# Altium project CameraController.PrjPcb (part 1 of 2)
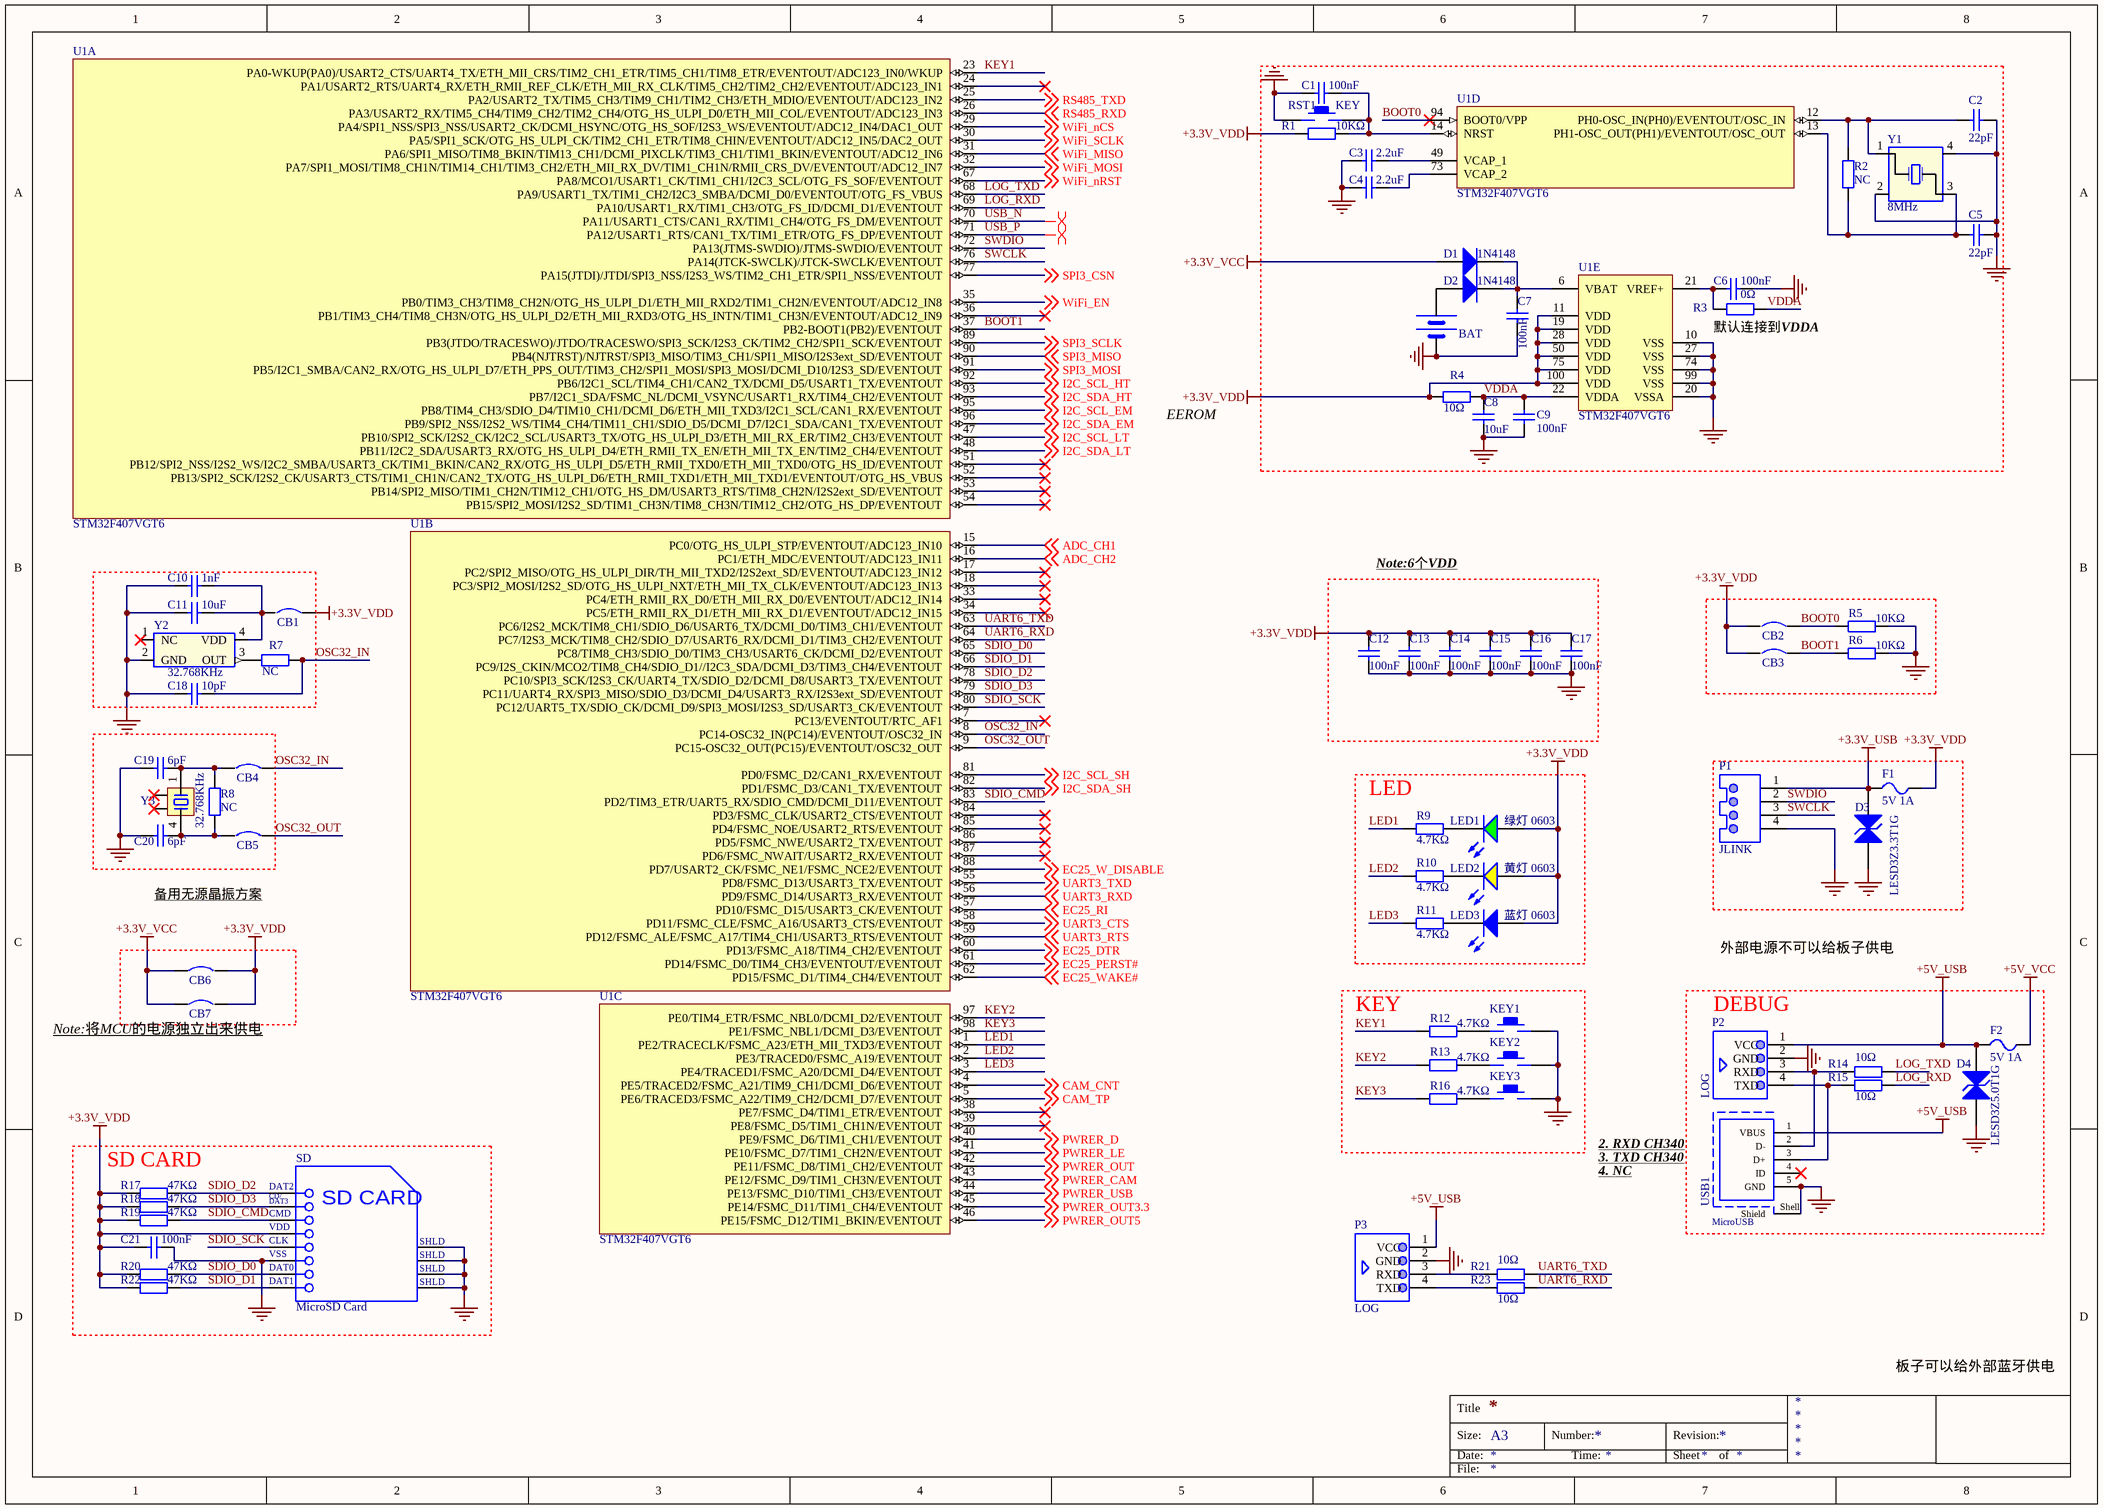
[diagram p0: MCU_F2.SchDoc]
4 sheets, 271 parts. Net scope: global (net labels, ports and power ports of the same name join across sheets).
Board file: Board2.PcbDoc
Sheets:
  MCU_F2.SchDoc
  PWR_F2.SchDoc
  WiFi&4G_F2.SchDoc
  Device_F2.SchDoc

## Sheet MCU_F2.SchDoc
size A3

### Parts
BAT  BAT CR1220  [CR1220_B]  (value not drawn)
C1  100nF  [0603_C]
C2  22pF  [0402_C]
C3  2.2uF  [0603_C]
C4  2.2uF  [0603_C]
C5  22pF  [0402_C]
C6  100nF  [0402_C]
C7  100nF  [0402_C]
C8  10uF  [0805_C]
C9  100nF  [0402_C]
C10  1nF  [0402_C]
C11  10uF  [0603_C]
C12  100nF  [0402_C]
C13  100nF  [0402_C]
C14  100nF  [0402_C]
C15  100nF  [0402_C]
C16  100nF  [0402_C]
C17  100nF  [0402_C]
C18  10pF  [0402_C]
C19  6pF  [0402_C]
C20  6pF  [0402_C]
C21  100nF  [0402_C]
CB1  CB  [CW]  (value not drawn)  (no BOM)
CB2  CB  [CW]  (value not drawn)  (no BOM)
CB3  CB  [CW]  (value not drawn)  (no BOM)
CB4  CB  [CW]  (value not drawn)  (no BOM)
CB5  CB  [CW]  (value not drawn)  (no BOM)
CB6  CB  [CW]  (value not drawn)  (no BOM)
CB7  CB  [CW]  (value not drawn)  (no BOM)
D1  1N4148  [SOD-323]
D2  1N4148  [SOD-323]
D3  LESD3Z3.3T1G  [SOD-323]
D4  LESD3Z5.0T1G  [SOD-323]
F1  5V 1A  [FU 0603]
F2  5V 1A  [FU 0603]
KEY1  KEY  [TSW SMD-6*6*5]  (value not drawn)
KEY2  KEY  [TSW SMD-6*6*5]  (value not drawn)
KEY3  KEY  [TSW SMD-6*6*5]  (value not drawn)
LED1  绿灯 0603  [0603_LED_S1]
LED2  黄灯 0603  [0603_LED_S1]
LED3  蓝灯 0603  [0603_LED_S1]
P1  JLINK  [XH2.54-4P]
P2  LOG  [HDR-4P UART]
P3  LOG  [HDR-4P UART]
R1  10KΩ  [0603_R]
R2  NC  [0402_R]
R3  0Ω  [0402_R]
R4  10Ω  [0402_R]
R5  10KΩ  [0402_R]
R6  10KΩ  [0402_R]
R7  NC  [0402_R]
R8  NC  [0402_R]
R9  4.7KΩ  [0603_R]
R10  4.7KΩ  [0603_R]
R11  4.7KΩ  [0603_R]
R12  4.7KΩ  [0603_R]
R13  4.7KΩ  [0603_R]
R14  10Ω  [0402_R]
R15  10Ω  [0402_R]
R16  4.7KΩ  [0603_R]
R17  47KΩ  [0402_R]
R18  47KΩ  [0402_R]
R19  47KΩ  [0402_R]
R20  47KΩ  [0402_R]
R21  10Ω  [0402_R]
R22  47KΩ  [0402_R]
R23  10Ω  [0402_R]
RST1  KEY  [TSW SMD-4*4*1.5]
SD  MicroSD Card  [MOLX-47219-2001-8_V]
U1  STM32F407VGT6  [STM-LQFP100_L]  (parts A,B,C,D,E of 5)
USB1  MicroUSB  [MOLX-47589-0001]
Y1  8MHz  [XTAL-5032-4P]
Y2  32.768KHz  [XTAL-3225-4P]
Y3  32.768KHz  [OSC MC-306]

### Blocks framed on the sheet
默认连接到VDDA: BAT C1-C9 D1 D2 R1-R4 RST1 U1 Y1
Note:6个VDD: C12-C17
LED: LED1-LED3 R9-R11
KEY: KEY1-KEY3 R12 R13 R16
DEBUG: D4 F2 P2 R14 R15 USB1
SD CARD: C21 R17-R20 R22 SD

### Nets
+3.3V_USB: D3.2(K) F1.1 P1.1
+3.3V_VCC: CB6.1 CB7.1 D1.1(A)
+3.3V_VDD: C12.1 C13.1 C14.1 C15.1 C16.1 C17.1 C21.1 CB1.2 CB2.1 CB3.1 CB6.2 CB7.2 F1.2 LED1.A LED2.A LED3.A R1.1 R4.1 R17.1 R18.1 R19.1 R20.1 R22.1 SD.4(VDD) U1.11(VDD) U1.19(VDD) U1.28(VDD) U1.50(VDD) U1.75(VDD) U1.100(VDD)
+5V_USB: D4.2(K) F2.1 P2.1(VCC) P3.1(VCC) USB1.1(VBUS)
+5V_VCC: F2.2
GND: BAT.2(GND) C1.1 C2.2 C3.1 C4.1 C5.2 C6.1 C7.2 C8.1 C9.1 C10.1 C11.1 C12.2 C13.2 C14.2 C15.2 C16.2 C17.2 C18.1 C19.2 C20.2 C21.2 D3.1(A) D4.1(A) KEY1.2 KEY2.2 KEY3.2 P1.4 P2.2(GND) P3.2(GND) R5.2 R6.2 RST1.1 SD.6(VSS) SD.9(SHLD) SD.10(SHLD) SD.11(SHLD) SD.12(SHLD) U1.10(VSS) U1.20(VSSA) U1.27(VSS) U1.74(VSS) U1.99(VSS) USB1.5(GND) USB1.Shell(Shield) Y1.2 Y1.4 Y2.2(GND)
ADC_CH1: U1.15(PC0/OTG_HS_ULPI_STP/EVENTOUT/ADC123_IN10) ; off-sheet ADC_CH1
ADC_CH2: U1.16(PC1/ETH_MDC/EVENTOUT/ADC123_IN11) ; off-sheet ADC_CH2
BOOT0: CB2.2 R5.1 U1.94(BOOT0/VPP)
BOOT1: CB3.2 R6.1 U1.37(PB2-BOOT1(PB2)/EVENTOUT)
CAM_CNT: U1.4(PE5/TRACED2/FSMC_A21/TIM9_CH1/DCMI_D6/EVENTOUT) ; off-sheet CAM_CNT
CAM_TP: U1.5(PE6/TRACED3/FSMC_A22/TIM9_CH2/DCMI_D7/EVENTOUT) ; off-sheet CAM_TP
EC25_DTR: U1.60(PD13/FSMC_A18/TIM4_CH2/EVENTOUT) ; off-sheet EC25_DTR
EC25_PERST#: U1.61(PD14/FSMC_D0/TIM4_CH3/EVENTOUT/EVENTOUT) ; off-sheet EC25_PERST#
EC25_RI: U1.57(PD10/FSMC_D15/USART3_CK/EVENTOUT) ; off-sheet EC25_RI
EC25_W_DISABLE: U1.88(PD7/USART2_CK/FSMC_NE1/FSMC_NCE2/EVENTOUT) ; off-sheet EC25_W_DISABLE
EC25_WAKE#: U1.62(PD15/FSMC_D1/TIM4_CH4/EVENTOUT) ; off-sheet EC25_WAKE#
I2C_SCL_EM: U1.95(PB8/TIM4_CH3/SDIO_D4/TIM10_CH1/DCMI_D6/ETH_MII_TXD3/I2C1_SCL/CAN1_RX/EVENTOUT) ; off-sheet I2C_SCL_EM
I2C_SCL_HT: U1.92(PB6/I2C1_SCL/TIM4_CH1/CAN2_TX/DCMI_D5/USART1_TX/EVENTOUT) ; off-sheet I2C_SCL_HT
I2C_SCL_LT: U1.47(PB10/SPI2_SCK/I2S2_CK/I2C2_SCL/USART3_TX/OTG_HS_ULPI_D3/ETH_MII_RX_ER/TIM2_CH3/EVENTOUT) ; off-sheet I2C_SCL_LT
I2C_SCL_SH: U1.81(PD0/FSMC_D2/CAN1_RX/EVENTOUT) ; off-sheet I2C_SCL_SH
I2C_SDA_EM: U1.96(PB9/SPI2_NSS/I2S2_WS/TIM4_CH4/TIM11_CH1/SDIO_D5/DCMI_D7/I2C1_SDA/CAN1_TX/EVENTOUT) ; off-sheet I2C_SDA_EM
I2C_SDA_HT: U1.93(PB7/I2C1_SDA/FSMC_NL/DCMI_VSYNC/USART1_RX/TIM4_CH2/EVENTOUT) ; off-sheet I2C_SDA_HT
I2C_SDA_LT: U1.48(PB11/I2C2_SDA/USART3_RX/OTG_HS_ULPI_D4/ETH_RMII_TX_EN/ETH_MII_TX_EN/TIM2_CH4/EVENTOUT) ; off-sheet I2C_SDA_LT
I2C_SDA_SH: U1.82(PD1/FSMC_D3/CAN1_TX/EVENTOUT) ; off-sheet I2C_SDA_SH
KEY1: R12.1 U1.23(PA0-WKUP(PA0)/USART2_CTS/UART4_TX/ETH_MII_CRS/TIM2_CH1_ETR/TIM5_CH1/TIM8_ETR/EVENTOUT/ADC123_IN0/WKUP)
KEY2: R13.1 U1.97(PE0/TIM4_ETR/FSMC_NBL0/DCMI_D2/EVENTOUT)
KEY3: R16.1 U1.98(PE1/FSMC_NBL1/DCMI_D3/EVENTOUT)
LED1: R9.1 U1.1(PE2/TRACECLK/FSMC_A23/ETH_MII_TXD3/EVENTOUT)
LED2: R10.1 U1.2(PE3/TRACED0/FSMC_A19/EVENTOUT)
LED3: R11.1 U1.3(PE4/TRACED1/FSMC_A20/DCMI_D4/EVENTOUT)
LOG_RXD: R15.2 U1.69(PA10/USART1_RX/TIM1_CH3/OTG_FS_ID/DCMI_D1/EVENTOUT)
LOG_TXD: R14.2 U1.68(PA9/USART1_TX/TIM1_CH2/I2C3_SMBA/DCMI_D0/EVENTOUT/OTG_FS_VBUS)
OSC32_IN: C18.2 CB4.2 R7.2 U1.8(PC14-OSC32_IN(PC14)/EVENTOUT/OSC32_IN)
OSC32_OUT: CB5.2 U1.9(PC15-OSC32_OUT(PC15)/EVENTOUT/OSC32_OUT)
PWRER_CAM: U1.43(PE12/FSMC_D9/TIM1_CH3N/EVENTOUT) ; off-sheet PWRER_CAM
PWRER_D: U1.40(PE9/FSMC_D6/TIM1_CH1/EVENTOUT) ; off-sheet PWRER_D
PWRER_LE: U1.41(PE10/FSMC_D7/TIM1_CH2N/EVENTOUT) ; off-sheet PWRER_LE
PWRER_OUT: U1.42(PE11/FSMC_D8/TIM1_CH2/EVENTOUT) ; off-sheet PWRER_OUT
PWRER_OUT3.3: U1.45(PE14/FSMC_D11/TIM1_CH4/EVENTOUT) ; off-sheet PWRER_OUT3.3
PWRER_OUT5: U1.46(PE15/FSMC_D12/TIM1_BKIN/EVENTOUT) ; off-sheet PWRER_OUT5
PWRER_USB: U1.44(PE13/FSMC_D10/TIM1_CH3/EVENTOUT) ; off-sheet PWRER_USB
RS485_RXD: U1.26(PA3/USART2_RX/TIM5_CH4/TIM9_CH2/TIM2_CH4/OTG_HS_ULPI_D0/ETH_MII_COL/EVENTOUT/ADC123_IN3) ; off-sheet RS485_RXD
RS485_TXD: U1.25(PA2/USART2_TX/TIM5_CH3/TIM9_CH1/TIM2_CH3/ETH_MDIO/EVENTOUT/ADC123_IN2) ; off-sheet RS485_TXD
SDIO_CMD: R19.2 SD.3(CMD) U1.83(PD2/TIM3_ETR/UART5_RX/SDIO_CMD/DCMI_D11/EVENTOUT)
SDIO_D0: R20.2 SD.7(DAT0) U1.65(PC8/TIM8_CH3/SDIO_D0/TIM3_CH3/USART6_CK/DCMI_D2/EVENTOUT)
SDIO_D1: R22.2 SD.8(DAT1) U1.66(PC9/I2S_CKIN/MCO2/TIM8_CH4/SDIO_D1//I2C3_SDA/DCMI_D3/TIM3_CH4/EVENTOUT)
SDIO_D2: R17.2 SD.1(DAT2) U1.78(PC10/SPI3_SCK/I2S3_CK/UART4_TX/SDIO_D2/DCMI_D8/USART3_TX/EVENTOUT)
SDIO_D3: R18.2 SD.2(CD/DAT3) U1.79(PC11/UART4_RX/SPI3_MISO/SDIO_D3/DCMI_D4/USART3_RX/I2S3ext_SD/EVENTOUT)
SDIO_SCK: SD.5(CLK) U1.80(PC12/UART5_TX/SDIO_CK/DCMI_D9/SPI3_MOSI/I2S3_SD/USART3_CK/EVENTOUT)
SPI3_CSN: U1.77(PA15(JTDI)/JTDI/SPI3_NSS/I2S3_WS/TIM2_CH1_ETR/SPI1_NSS/EVENTOUT) ; off-sheet SPI3_CSN
SPI3_MISO: U1.90(PB4(NJTRST)/NJTRST/SPI3_MISO/TIM3_CH1/SPI1_MISO/I2S3ext_SD/EVENTOUT) ; off-sheet SPI3_MISO
SPI3_MOSI: U1.91(PB5/I2C1_SMBA/CAN2_RX/OTG_HS_ULPI_D7/ETH_PPS_OUT/TIM3_CH2/SPI1_MOSI/SPI3_MOSI/DCMI_D10/I2S3_SD/EVENTOUT) ; off-sheet SPI3_MOSI
SPI3_SCLK: U1.89(PB3(JTDO/TRACESWO)/JTDO/TRACESWO/SPI3_SCK/I2S3_CK/TIM2_CH2/SPI1_SCK/EVENTOUT) ; off-sheet SPI3_SCLK
SWCLK: P1.3 U1.76(PA14(JTCK-SWCLK)/JTCK-SWCLK/EVENTOUT)
SWDIO: P1.2 U1.72(PA13(JTMS-SWDIO)/JTMS-SWDIO/EVENTOUT)
UART3_CTS: U1.58(PD11/FSMC_CLE/FSMC_A16/USART3_CTS/EVENTOUT) ; off-sheet UART3_CTS
UART3_RTS: U1.59(PD12/FSMC_ALE/FSMC_A17/TIM4_CH1/USART3_RTS/EVENTOUT) ; off-sheet UART3_RTS
UART3_RXD: U1.56(PD9/FSMC_D14/USART3_RX/EVENTOUT) ; off-sheet UART3_RXD
UART3_TXD: U1.55(PD8/FSMC_D13/USART3_TX/EVENTOUT) ; off-sheet UART3_TXD
UART6_RXD: R23.2 U1.64(PC7/I2S3_MCK/TIM8_CH2/SDIO_D7/USART6_RX/DCMI_D1/TIM3_CH2/EVENTOUT)
UART6_TXD: R21.2 U1.63(PC6/I2S2_MCK/TIM8_CH1/SDIO_D6/USART6_TX/DCMI_D0/TIM3_CH1/EVENTOUT)
USB_N: U1.70(PA11/USART1_CTS/CAN1_RX/TIM1_CH4/OTG_FS_DM/EVENTOUT)
USB_P: U1.71(PA12/USART1_RTS/CAN1_TX/TIM1_ETR/OTG_FS_DP/EVENTOUT)
VDDA: C8.2 C9.2 R3.2 R4.2 U1.22(VDDA)
WiFi_EN: U1.35(PB0/TIM3_CH3/TIM8_CH2N/OTG_HS_ULPI_D1/ETH_MII_RXD2/TIM1_CH2N/EVENTOUT/ADC12_IN8) ; off-sheet WiFi_EN
WiFi_MISO: U1.31(PA6/SPI1_MISO/TIM8_BKIN/TIM13_CH1/DCMI_PIXCLK/TIM3_CH1/TIM1_BKIN/EVENTOUT/ADC12_IN6) ; off-sheet WiFi_MISO
WiFi_MOSI: U1.32(PA7/SPI1_MOSI/TIM8_CH1N/TIM14_CH1/TIM3_CH2/ETH_MII_RX_DV/TIM1_CH1N/RMII_CRS_DV/EVENTOUT/ADC12_IN7) ; off-sheet WiFi_MOSI
WiFi_nCS: U1.29(PA4/SPI1_NSS/SPI3_NSS/USART2_CK/DCMI_HSYNC/OTG_HS_SOF/I2S3_WS/EVENTOUT/ADC12_IN4/DAC1_OUT) ; off-sheet WiFi_nCS
WiFi_nRST: U1.67(PA8/MCO1/USART1_CK/TIM1_CH1/I2C3_SCL/OTG_FS_SOF/EVENTOUT) ; off-sheet WiFi_nRST
WiFi_SCLK: U1.30(PA5/SPI1_SCK/OTG_HS_ULPI_CK/TIM2_CH1_ETR/TIM8_CHIN/EVENTOUT/ADC12_IN5/DAC2_OUT) ; off-sheet WiFi_SCLK
NetBAT_1: BAT.1(VCC) D2.1(A)
NetC1_2: C1.2 R1.2 RST1.2 U1.14(NRST)
NetC2_1: C2.1 R2.2 U1.12(PH0-OSC_IN(PH0)/EVENTOUT/OSC_IN) Y1.1
NetC3_2: C3.2 U1.49(VCAP_1)
NetC4_2: C4.2 U1.73(VCAP_2)
NetC5_1: C5.1 R2.1 U1.13(PH1-OSC_OUT(PH1)/EVENTOUT/OSC_OUT) Y1.3
NetC6_2: C6.2 R3.1 U1.21(VREF+)
NetC7_1: C7.1 D1.2(K) D2.2(K) U1.6(VBAT)
NetC10_2: C10.2 C11.2 CB1.1 Y2.4(VDD)
NetC19_1: C19.1 CB4.1 R8.1 Y3.1
NetC20_1: C20.1 CB5.1 R8.2 Y3.4
NetKEY1_1: KEY1.1 R12.2
NetKEY2_1: KEY2.1 R13.2
NetKEY3_1: KEY3.1 R16.2
NetLED1_K: LED1.K R9.2
NetLED2_K: LED2.K R10.2
NetLED3_K: LED3.K R11.2
NetP2_3: P2.3(RXD) R14.1 USB1.2(D-)
NetP2_4: P2.4(TXD) R15.1 USB1.3(D+)
NetP3_3: P3.3(RXD) R21.1
NetP3_4: P3.4(TXD) R23.1
NetR7_1: R7.1 Y2.3(OUT)

Not connected (* = marked no-connect by the designer): U1 7(PC13/EVENTOUT/RTC_AF1)* 17(PC2/SPI2_MISO/OTG_HS_ULPI_DIR/TH_MII_TXD2/I2S2ext_SD/EVENTOUT/ADC123_IN12)* 18(PC3/SPI2_MOSI/I2S2_SD/OTG_HS_ULPI_NXT/ETH_MII_TX_CLK/EVENTOUT/ADC123_IN13)* 24(PA1/USART2_RTS/UART4_RX/ETH_RMII_REF_CLK/ETH_MII_RX_CLK/TIM5_CH2/TIM2_CH2/EVENTOUT/ADC123_IN1)* 33(PC4/ETH_RMII_RX_D0/ETH_MII_RX_D0/EVENTOUT/ADC12_IN14)* 34(PC5/ETH_RMII_RX_D1/ETH_MII_RX_D1/EVENTOUT/ADC12_IN15)* 36(PB1/TIM3_CH4/TIM8_CH3N/OTG_HS_ULPI_D2/ETH_MII_RXD3/OTG_HS_INTN/TIM1_CH3N/EVENTOUT/ADC12_IN9)* 38(PE7/FSMC_D4/TIM1_ETR/EVENTOUT)* 39(PE8/FSMC_D5/TIM1_CH1N/EVENTOUT)* 51(PB12/SPI2_NSS/I2S2_WS/I2C2_SMBA/USART3_CK/TIM1_BKIN/CAN2_RX/OTG_HS_ULPI_D5/ETH_RMII_TXD0/ETH_MII_TXD0/OTG_HS_ID/EVENTOUT)* 52(PB13/SPI2_SCK/I2S2_CK/USART3_CTS/TIM1_CH1N/CAN2_TX/OTG_HS_ULPI_D6/ETH_RMII_TXD1/ETH_MII_TXD1/EVENTOUT/OTG_HS_VBUS)* 53(PB14/SPI2_MISO/TIM1_CH2N/TIM12_CH1/OTG_HS_DM/USART3_RTS/TIM8_CH2N/I2S2ext_SD/EVENTOUT)* 54(PB15/SPI2_MOSI/I2S2_SD/TIM1_CH3N/TIM8_CH3N/TIM12_CH2/OTG_HS_DP/EVENTOUT)* 84(PD3/FSMC_CLK/USART2_CTS/EVENTOUT)* 85(PD4/FSMC_NOE/USART2_RTS/EVENTOUT)* 86(PD5/FSMC_NWE/USART2_TX/EVENTOUT)* 87(PD6/FSMC_NWAIT/USART2_RX/EVENTOUT)*; USB1 4(ID)*; Y2 1(NC)*; Y3 2* 3*

### Layout directives
differential pair: USB_N, USB_P

### Notes on the sheet
- EEROM
- 备用无源晶振方案
- 外部电源不可以给板子供电
- (near CB7) Note:将MCU的电源独立出来供电
- 2. RXD CH340
- 3. TXD CH340
- 4. NC
- 板子可以给外部蓝牙供电
- Title
- Size:
- Date:
- A3
- Number:
- Time:
- Revision:
- Sheet
- of
- File:
- *
- (in symbol MicroSD_Card) CD/; DAT3; SD CARD

### Library data of the parts
C1 = Cap 0603 100nF (104) 10% 50V: 贴片电容; ComponentLink1Description: 供应商链接; ComponentLink1URL: http://www.szlcsc.com/product/details_15331.html; Package: 0603; Supplier: LC; SuppliersPartNumber: C14663
C2 C5 = Cap 0402 22pF (220) 5% 50V: 贴片电容; ComponentLink1Description: 供应商链接; ComponentLink1URL: http://www.szlcsc.com/product/details_1907.html; Package: 0402; Supplier: LC; SuppliersPartNumber: C1555
C3 C4 = Cap 0603 2.2uF (225) 10% 16V: 贴片电容; ComponentLink1Description: 供应商链接; ComponentLink1URL: http://www.szlcsc.com/product/details_24366.html; Package: 0603; Supplier: LC; SuppliersPartNumber: C23630
C6 C7 C9 C12-C17 C21 = Cap 0402 100nF (104) 10% 16V: 贴片电容; ComponentLink1Description: 供应商链接; ComponentLink1URL: http://www.szlcsc.com/product/details_1877.html; Package: 0402; Supplier: LC; SuppliersPartNumber: C1525
  C12: Value: 100nF
C8 = Cap 0805 10uF (106) 10% 25V: 贴片电容; ComponentLink1Description: 供应商链接; ComponentLink1URL: http://www.szlcsc.com/product/details_16532.html; Package: 0805; Supplier: LC; SuppliersPartNumber: C15850; Value: 10uF
C10 = Cap 0402 1nF (102) 10% 50V: 贴片电容; ComponentLink1Description: 供应商链接; ComponentLink1URL: http://www.szlcsc.com/product/details_1875.html; Package: 0402; Supplier: LC; SuppliersPartNumber: C1523; Value: 1nF
C11 = Cap 0603 10uF (106) 10% 10V: 贴片电容; ComponentLink1Description: 供应商链接; ComponentLink1URL: http://www.szlcsc.com/product/details_20411.html; Package: 0603; Supplier: LC; SuppliersPartNumber: C19702
C18 = Cap 0402 10pF (100) 5% 50V: 贴片电容; ComponentLink1Description: 供应商链接; ComponentLink1URL: http://www.szlcsc.com/product/details_33914.html; Package: 0402; Supplier: LC; SuppliersPartNumber: C32949
C19 C20 = Cap 0402 6pF (6R0) 0.25pF 50V: 贴片电容; ComponentLink1Description: 供应商链接; ComponentLink1URL: http://www.szlcsc.com/product/details_31031.html; Package: 0402; Supplier: LC; SuppliersPartNumber: C30274
CB1-CB7 = Circuit Breaker: Published: 24-Mar-1999; LatestRevisionDate: 17-Jul-2002; LatestRevisionNote: Re-released for DXP Platform.; PackageReference: SPST-2; Publisher: Altium Limited
D1 D2 = DIO SOD-323 1N4148WS T4: 二极管; ComponentLink1Description: 供应商链接; ComponentLink1URL: http://www.szlcsc.com/product/details_2485.html; Package: SOD-323; Supplier: LC; SuppliersPartNumber: C2128
D3 = SOD-323 LESD3Z3.3T1G: TVS/ESD, SOD-323, 3.3V; ComponentLink1Description: 供应商链接; ComponentLink1URL: http://www.szlcsc.com/product/details_79530.html; Package: SMB/DO-214AA; Supplier: LC; SuppliersPartNumber: C78395
D4 = SOD-323 LESD3Z5.0T1G: TVS/ESD, SOD-323, 5V; ComponentLink1Description: 供应商链接; ComponentLink1URL: http://www.szlcsc.com/product/details_79530.html; Package: SMB/DO-214AA; Supplier: LC; SuppliersPartNumber: C78395
F1 F2 = FU PPTC MSMD 5V 1A: 自恢复保险丝; BOM名称: 贴片保险丝; 版权归属: 源创客; 学习资源: www.ooocke.com
KEY1-KEY3 = KEY_M
LED1 = LED 0603 绿灯: 发光二极管; ComponentLink1Description: 供应商链接; ComponentLink1URL: http://www.szlcsc.com/product/details_73152.html; Package: 0603; Supplier: LC; SuppliersPartNumber: C72043
LED2 = LED 0603 黄灯: 发光二极管; ComponentLink1Description: 供应商链接; ComponentLink1URL: http://www.szlcsc.com/product/details_73147.html; Package: 0603; Supplier: LC; SuppliersPartNumber: C72038
LED3 = LED 0603 蓝灯: 发光二极管; ComponentLink1Description: 供应商链接; ComponentLink1URL: http://www.szlcsc.com/product/details_73150.html; Package: 0603; Supplier: LC; SuppliersPartNumber: C72041
P1 = Header XH-2.56-4P: Male Header, Pitch 2.5 mm, 1 x 4 Position, Height 7 mm, Tail Length 8.4 mm, -25 to 85 degC, RoHS, Bulk; Manufacturer: JST; No of Positions: 2; Pitch: 2.5mm; Style/Orientation: StraightHeader/Plug; Datasheet Version: 05/2016; Package Description: Male Header, Pitch 2.5 mm, 1 x 2 Position, Height 7 mm, Tail Length 3.4 mm; Package Reference: B2B-XH-A; Mounting Technology: ThroughHole; Type: ShroudedHeader; Datasheet URL: http://www.jst-mfg.com/product/pdf/eng/eXH.pdf; Manufacturer URL: http://www.jst.com/home2.html; Termination: Crimp
P2 P3 = HAR-4P UART: Header, 4-Pin; LatestRevisionDate: 17-Jul-2002; LatestRevisionNote: Re-released for DXP Platform.; Publisher: Altium Limited
R1 = Res 0603 10KΩ (1002) 1%: 贴片电阻; ComponentLink1Description: 供应商链接; ComponentLink1URL: http://www.szlcsc.com/product/details_26547.html; Package: 0603; Supplier: LC; SuppliersPartNumber: C25804
R2 R8 = Res 0402 1MΩ (1004) 1%: 贴片电阻; Value: 1MΩ; ComponentLink1Description: 供应商链接; ComponentLink1URL: http://www.szlcsc.com/product/details_26826.html; Package: 0402; Supplier: LC; SuppliersPartNumber: C26083
R3 = Res 0402 0Ω (0R0) 1%: 贴片电阻; ComponentLink1Description: 供应商链接; ComponentLink1URL: http://www.szlcsc.com/product/details_17853.html; Package: 0402; Supplier: LC; SuppliersPartNumber: C17168; Value: 0Ω
R4 R7 R14 R15 R21 R23 = Res 0402 10Ω (10R0) 1%: 贴片电阻; ComponentLink1Description: 供应商链接; ComponentLink1URL: http://www.szlcsc.com/product/details_25820.html; Package: 0402; Supplier: LC; SuppliersPartNumber: C25077
R5 R6 = Res 0402 10KΩ (1002) 1%: 贴片电阻; ComponentLink1Description: 供应商链接; ComponentLink1URL: http://www.szlcsc.com/product/details_26487.html; Package: 0402; Supplier: LC; SuppliersPartNumber: C25744; Value: 10KΩ
R9-R13 R16 = Res 0603 4.7KΩ (4701) 1%: 贴片电阻; ComponentLink1Description: 供应商链接; ComponentLink1URL: http://www.szlcsc.com/product/details_23889.html; Package: 0603; Supplier: LC; SuppliersPartNumber: C23162
R17-R20 R22 = Res 0402 47KΩ (4702) 1%: 贴片电阻; ComponentLink1Description: 供应商链接; ComponentLink1URL: http://www.szlcsc.com/product/details_26535.html; Package: 0402; Supplier: LC; SuppliersPartNumber: C25792
RST1 = KEY_TWS
SD = MicroSD_Card: MicroSD Card Connector, Hinge Type, -40 to 85 degC, 8-Pin SMD, RoHS, Tape and Reel, CMP-2000-05245-1; Manufacturer: Molex; Current Rating: 500mA; Number of Contacts: 8; Pitch: 1.09mm; Insertion - Extraction Style: Hinged; Voltage Rating: 100VDC; Product: CardConnectors; Contact Material: CopperAlloy; Series: 47219; Packaging: Reel; Brand: Molex; Product Category: MemoryCardConnectors; Housing Material: Thermoplastic; Mounting Style: SMD/SMT; Termination Style: SMD; Datasheet Version: Rev. F, 06/2009; Card Type: microSD; Manufacturer URL: http://www.molex.com/; RoHS: Details; Datasheet URL: http://www.molex.com/pdm_docs/sd/472192001_sd.pdf; Factory Pack Quantity: 2400
U1 = STM32F407VGT6: ARM; ComponentLink1Description: 供应商链接; ComponentLink1URL: http://www.szlcsc.com/product/details_12968.html; Package: LQFP-100_14x14x05P; Supplier: LC; SuppliersPartNumber: C12345
USB1 = MicroUSB MOLX-47589-0001: Right Angle Female Type AB Micro USB Connector, 30 V, 1.8 A, -30 to 85 degC, RoHS, Tape and Reel; Part Number: 629105150921; Manufacturer: Wurth Elektronik; Rated Current: 1.8A; Contact Resistance: 30mOhm; Gender: Receptacle; Working Voltage: 30VAC; Connector Type: MicroUSB2.0TypeAB; Publisher: WurthElektronik; Operating Temperature: -40to85degC; Packaging: TapeandReel; Datasheet URL: https://katalog.we-online.de/em/datasheet/629105150921.pdf; Mounting Technology: SMT; Orientation: Horizontal; Package Reference: 629105150921; Manufacturer URL: http://www.we-online.de
Y1 = XTAL SMD-5032_4P 8MHz 10ppm 20pF: 贴片晶振; 402F40012IKR; 8MHz 10ppm 20pF -40C +85C; CLASS: IC
Y2 = XTAL SMD-3225 32.768KHz: 有源贴片晶振; CLASS: IC
Y3 = XTAL-MC306: 4脚晶振; 版权归属: 源创客; BOM名称: 4脚晶振; 学习资源: www.ooocke.com

## Sheet PWR_F2.SchDoc
size A3; Organization: Altium Limited; Address1: L3, 12a Rodborough Rd; Address2: Frenchs Forest; Address3: NSW; Address4: Australia 2086
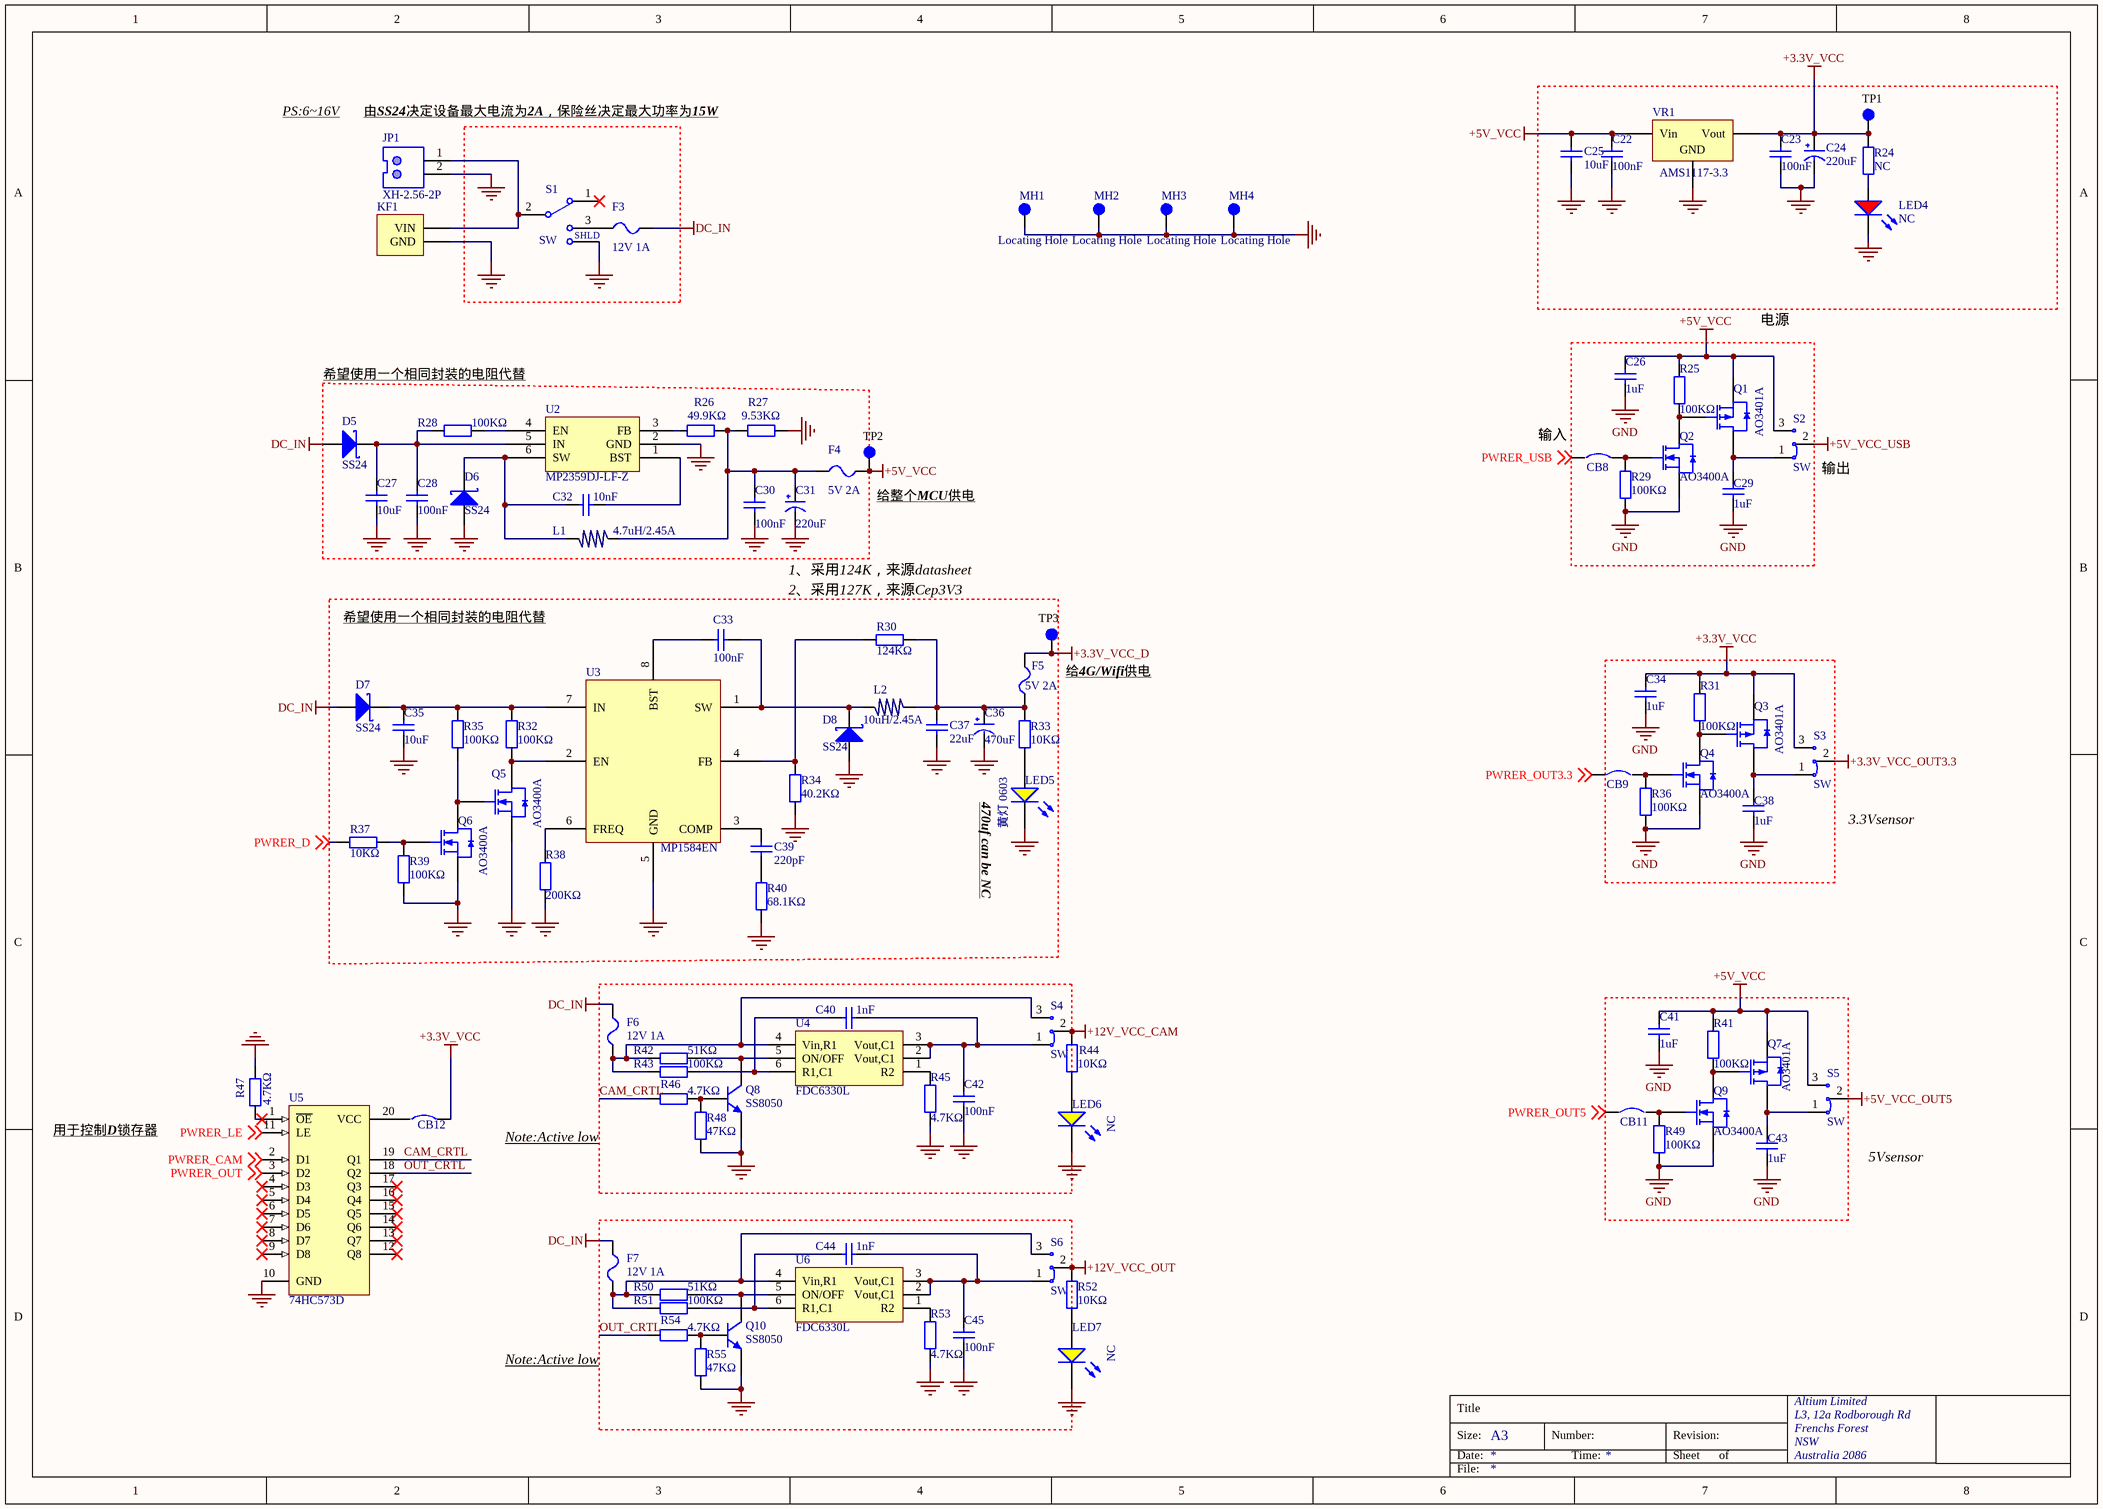
[diagram p1: PWR_F2.SchDoc]

### Parts
C22  100nF  [0603_C]
C23  100nF  [0603_C]
C24  220uF  [CT 6*6 - C]
C25  10uF  [0805_C]
C26  1uF  [0603_C]
C27  10uF  [0805_C]
C28  100nF  [0603_C]
C29  1uF  [0603_C]
C30  100nF  [0603_C]
C31  220uF  [CT 6*6 - C]
C32  10nF  [0603_C]
C33  100nF  [0603_C]
C34  1uF  [0603_C]
C35  10uF  [1206_C]
C36  470uF  [CT 8*7 - C]
C37  22uF  [0805_C]
C38  1uF  [0603_C]
C39  220pF  [0603_C]
C40  1nF  [0603_C]
C41  1uF  [0603_C]
C42  100nF  [0603_C]
C43  1uF  [0603_C]
C44  1nF  [0603_C]
C45  100nF  [0603_C]
CB8  CB  [CW]  (value not drawn)  (no BOM)
CB9  CB  [CW]  (value not drawn)  (no BOM)
CB11  CB  [CW]  (value not drawn)  (no BOM)
CB12  CB  [CW]  (value not drawn)  (no BOM)
D5  SS24  [SMA(DO-214AC)_S1]
D6  SS24  [SMA(DO-214AC)_S1]
D7  SS24  [SMA(DO-214AC)_S1]
D8  SS24  [SMA(DO-214AC)_S1]
F3  12V 1A  [FU 0805]
F4  5V 2A  [FU 0805]
F5  5V 2A  [FU 0805]
F6  12V 1A  [FU 0805]
F7  12V 1A  [FU 0805]
JP1  XH-2.56-2P  [XH2.54-2P]
KF1  DC  [KF2EDGK-2.54-LI-2P]  (value not drawn)
L1  4.7uH/2.45A  [L_0630]
L2  10uH/2.45A  [L_0630]
LED4  NC  [0603_LED_S1]
LED5  黄灯 0603  [0603_LED_S1]
LED6  NC  [0603_LED_S1]
LED7  NC  [0603_LED_S1]
MH1  Locating Hole  [lh]
MH2  Locating Hole  [lh]
MH3  Locating Hole  [lh]
MH4  Locating Hole  [lh]
Q1  AO3401A  [SOT-23-3L]
Q2  AO3400A  [SOT-23-3L]
Q3  AO3401A  [SOT-23-3L]
Q4  AO3400A  [SOT-23-3L]
Q5  AO3400A  [SOT-23-3L]
Q6  AO3400A  [SOT-23-3L]
Q7  AO3401A  [SOT-23-3L]
Q8  SS8050  [SOT-23(SOT-23-3)]
Q9  AO3400A  [SOT-23-3L]
Q10  SS8050  [SOT-23(SOT-23-3)]
R24  NC  [0603_R]
R25  100KΩ  [0603_R]
R26  49.9KΩ  [0603_R]
R27  9.53KΩ  [0603_R]
R28  100KΩ  [0603_R]
R29  100KΩ  [0603_R]
R30  124KΩ  [0603_R]
R31  100KΩ  [0603_R]
R32  100KΩ  [0603_R]
R33  10KΩ  [0402_R]
R34  40.2KΩ  [0603_R]
R35  100KΩ  [0603_R]
R36  100KΩ  [0603_R]
R37  10KΩ  [0603_R]
R38  200KΩ  [0603_R]
R39  100KΩ  [0603_R]
R40  68.1KΩ  [0603_R]
R41  100KΩ  [0603_R]
R42  51KΩ  [0603_R]
R43  100KΩ  [0603_R]
R44  10KΩ  [0603_R]
R45  4.7KΩ  [0603_R]
R46  4.7KΩ  [0603_R]
R47  4.7KΩ  [0603_R]
R48  47KΩ  [0603_R]
R49  100KΩ  [0603_R]
R50  51KΩ  [0603_R]
R51  100KΩ  [0603_R]
R52  10KΩ  [0603_R]
R53  4.7KΩ  [0603_R]
R54  4.7KΩ  [0603_R]
R55  47KΩ  [0603_R]
S1  SW  [SS-12F23 (1P2T)  Straight foot]
S2  SW  [SWITCH_SPOT]
S3  SW  [SWITCH_SPOT]
S4  SW  [SWITCH_SPOT]
S5  SW  [SWITCH_SPOT]
S6  SW  [SWITCH_SPOT]
TP1  TP  [TP-SM-C-100-PIN]  (value not drawn)
TP2  TP  [TP-SM-C-100-PIN]  (value not drawn)
TP3  TP  [TP-SM-C-100-PIN]  (value not drawn)
U2  MP2359DJ-LF-Z  [SOT-23-6]
U3  MP1584EN  [SOIC-8_EP_150mil]
U4  FDC6330L  [SOT-23-6]
U5  74HC573D  [SSOP-20_208mil]
U6  FDC6330L  [SOT-23-6]
VR1  AMS1117-3.3  [SOT-223]

### Blocks framed on the sheet
电源: C26 C29 CB8 Q1 Q2 R25 R29 S2
希望使用一个相同封装的电阻代替: C27 C28 C30-C32 D5 D6 F4 L1 R26-R28 U2
2、采用127K，来源Cep3V3: C33 C35-C37 C39 D7 D8 F5 L2 LED5 Q5 Q6 R30 R32-R35 R37-R40 TP3 U3

### Nets
+3.3V_VCC: C23.2 C24.1(VCC) C34.2 CB12.2 Q3.2(S) R24.2 R31.2 S3.3 TP1.1 VR1.2(Vout)
+3.3V_VCC_D: F5.2 TP3.1
+3.3V_VCC_OUT3.3: S3.2
+5V_VCC: C22.2 C25.2 C26.2 C41.2 F4.2 Q1.2(S) Q7.2(S) R25.2 R41.2 S2.3 S5.3 TP2.1 VR1.3(Vin)
+5V_VCC_OUT5: S5.2
+5V_VCC_USB: S2.2
+12V_VCC_CAM: R44.2 S4.2
+12V_VCC_OUT: R52.2 S6.2
DC_IN: D5.1(A) D7.1(A) F3.2 F6.2 F7.2
GND: C22.1 C23.1 C24.2(GND) C25.1 C26.1 C27.2 C28.1 C29.1 C30.2 C31.2(GND) C34.1 C35.2 C36.2(GND) C37.1 C38.1 C41.1 C42.1 C43.1 C45.1 D6.1(A) D8.1(A) JP1.2 KF1.2(GND) LED4.K LED5.K LED6.K LED7.K MH1.1 MH2.1 MH3.1 MH4.1 Q2.2(S) Q4.2(S) Q5.2(S) Q6.2(S) Q8.2(E) Q9.2(S) Q10.2(E) R27.2 R29.1 R34.1 R36.1 R38.2 R39.1 R40.1 R45.2 R47.2 R48.2 R49.1 R53.2 R55.2 S1.0(shield) U2.2(GND) U3.5(GND) U5.10(GND) VR1.1(GND)
CAM_CRTL: R46.1 U5.19(Q1)
OUT_CRTL: R54.1 U5.18(Q2)
PWRER_CAM: U5.2(D1) ; off-sheet PWRER_CAM
PWRER_D: R37.1 ; off-sheet PWRER_D
PWRER_LE: U5.11(LE) ; off-sheet PWRER_LE
PWRER_OUT: U5.3(D2) ; off-sheet PWRER_OUT
PWRER_OUT3.3: CB9.1 ; off-sheet PWRER_OUT3.3
PWRER_OUT5: CB11.1 ; off-sheet PWRER_OUT5
PWRER_USB: CB8.1 ; off-sheet PWRER_USB
NetC27_1: C27.1 C28.2 D5.2(K) R28.2 U2.5(IN)
NetC29_2: C29.2 Q1.3(D) S2.1
NetC30_1: C30.1 C31.1(VCC) F4.1 L1.1 R26.1 R27.1
NetC32_1: C32.1 U2.1(BST)
NetC32_2: C32.2 D6.2(K) L1.2 U2.6(SW)
NetC33_1: C33.1 U3.8(BST)
NetC33_2: C33.2 D8.2(K) L2.1 U3.1(SW)
NetC35_1: C35.1 D7.2(K) R32.1 R35.1 U3.7(IN)
NetC36_1: C36.1(VCC) C37.2 F5.1 L2.2 R30.2 R33.2
NetC38_2: C38.2 Q3.3(D) S3.1
NetC39_1: C39.1 R40.2
NetC39_2: C39.2 U3.3(COMP)
NetC40_1: C40.1 C42.2 S4.1 U4.2(Vout,C1) U4.3(Vout,C1)
NetC40_2: C40.2 R43.1 U4.6(R1,C1)
NetC43_2: C43.2 Q7.3(D) S5.1
NetC44_1: C44.1 C45.2 S6.1 U6.2(Vout,C1) U6.3(Vout,C1)
NetC44_2: C44.2 R51.1 U6.6(R1,C1)
NetCB8_2: CB8.2 Q2.1(G) R29.2
NetCB9_2: CB9.2 Q4.1(G) R36.2
NetCB11_2: CB11.2 Q9.1(G) R49.2
NetCB12_1: CB12.1 U5.20(VCC)
NetF3_1: F3.1 S1.3
NetF6_1: F6.1 R42.2 R43.2 S4.3 U4.4(Vin,R1)
NetF7_1: F7.1 R50.2 R51.2 S6.3 U6.4(Vin,R1)
NetJP1_1: JP1.1 KF1.1(VIN) S1.2
NetLED4_A: LED4.A R24.1
NetLED5_A: LED5.A R33.1
NetLED6_A: LED6.A R44.1
NetLED7_A: LED7.A R52.1
NetQ1_1: Q1.1(G) Q2.3(D) R25.1
NetQ3_1: Q3.1(G) Q4.3(D) R31.1
NetQ5_1: Q5.1(G) Q6.3(D) R35.2
NetQ5_3: Q5.3(D) R32.2 U3.2(EN)
NetQ6_1: Q6.1(G) R37.2 R39.2
NetQ7_1: Q7.1(G) Q9.3(D) R41.1
NetQ8_1: Q8.1(B) R46.2 R48.1
NetQ8_3: Q8.3(C) R42.1 U4.5(ON/OFF)
NetQ10_1: Q10.1(B) R54.2 R55.1
NetQ10_3: Q10.3(C) R50.1 U6.5(ON/OFF)
NetR26_2: R26.2 U2.3(FB)
NetR28_1: R28.1 U2.4(EN)
NetR30_1: R30.1 R34.2 U3.4(FB)
NetR38_1: R38.1 U3.6(FREQ)
NetR45_1: R45.1 U4.1(R2)
NetR47_1: R47.1 U5.1(~{OE})
NetR53_1: R53.1 U6.1(R2)

Not connected (* = marked no-connect by the designer): S1 1*; U5 4(D3)* 5(D4)* 6(D5)* 7(D6)* 8(D7)* 9(D8)* 12(Q8)* 13(Q7)* 14(Q6)* 15(Q5)* 16(Q4)* 17(Q3)*

### Notes on the sheet
- PS:6~16V
- (near JP1) 由SS24决定设备最大电流为2A，保险丝决定最大功率为15W
- (near CB8) 输入
- 给整个MCU供电
- (near S2) 输出
- 1、采用124K，来源datasheet
- 希望使用一个相同封装的电阻代替
- 给4G/Wifi供电
- (near LED5) 470uf can be NC
- (near S3) 3.3Vsensor
- 用于控制D锁存器
- Note:Active low
- 5Vsensor
- Title
- Size:
- Date:
- A3
- Number:
- Time:
- Revision:
- Sheet
- of
- File:
- *
- (in symbol SW SSW-1P_2) SHLD

### Library data of the parts
C22 C23 C28 C30 C33 C42 C45 = Cap 0603 100nF (104) 10% 50V: 贴片电容; ComponentLink1Description: 供应商链接; ComponentLink1URL: http://www.szlcsc.com/product/details_15331.html; Package: 0603; Supplier: LC; SuppliersPartNumber: C14663
C24 C31 = Cap+ CT6.3*5.4 220uF/16V: 电解电容
C25 C27 = Cap 0805 10uF (106) 10% 25V: 贴片电容; ComponentLink1Description: 供应商链接; ComponentLink1URL: http://www.szlcsc.com/product/details_16532.html; Package: 0805; Supplier: LC; SuppliersPartNumber: C15850; Value: 10uF
C26 C29 C34 C38 C41 C43 = Cap 0603 1uF (105) 10% 50V: 贴片电容; ComponentLink1Description: 供应商链接; ComponentLink1URL: http://www.szlcsc.com/product/details_16531.html; Package: 0603; Supplier: LC; SuppliersPartNumber: C15849
C32 = Cap 0603 10nF (103) 10% 50V: 贴片电容; ComponentLink1Description: 供应商链接; ComponentLink1URL: http://www.szlcsc.com/product/details_58143.html; Package: 0603; Supplier: LC; SuppliersPartNumber: C57112
C35 = Cap 1206 10uF (106) 10% 50V: 贴片电容; ComponentLink1Description: 供应商链接; ComponentLink1URL: http://www.szlcsc.com/product/details_14236.html; Package: 1206; Supplier: LC; SuppliersPartNumber: C13585
C36 = Cap+ CT8*10.2 470uF/16V: 电解电容
C37 = Cap 0805 22uF (226) 20% 25V: 贴片电容; ComponentLink1Description: 供应商链接; ComponentLink1URL: http://www.szlcsc.com/product/details_46786.html; Package: 0805; Supplier: LC; SuppliersPartNumber: C45783
C39 = Cap 0603 220pF (221) 10% 50V: 贴片电容; ComponentLink1Description: 供应商链接; ComponentLink1URL: http://www.szlcsc.com/product/details_1955.html; Package: 0603; Supplier: LC; SuppliersPartNumber: C1603
C40 C44 = Cap 0603 1nF (102) 10% 50V: 贴片电容; ComponentLink1Description: 供应商链接; ComponentLink1URL: http://www.szlcsc.com/product/details_1940.html; Package: 0603; Supplier: LC; SuppliersPartNumber: C1588
CB8 CB9 CB11 CB12 = Circuit Breaker: Published: 24-Mar-1999; LatestRevisionDate: 17-Jul-2002; LatestRevisionNote: Re-released for DXP Platform.; PackageReference: SPST-2; Publisher: Altium Limited
D5-D8 = SMA(DO-214AC) SS24: 肖特基二极管; ComponentLink1Description: 供应商链接; ComponentLink1URL: http://www.szlcsc.com/product/details_23178.html; Package: SMA(DO-214AC); Supplier: LC; SuppliersPartNumber: C22452
F3 F6 F7 = FU PPTC MSMD 12V 1A: 自恢复保险丝; BOM名称: 贴片保险丝; 版权归属: 源创客; 学习资源: www.ooocke.com
F4 F5 = FU PPTC MSMD 5V 2A: 自恢复保险丝; BOM名称: 贴片保险丝; 版权归属: 源创客; 学习资源: www.ooocke.com
JP1 = Header XH-2.56-2P: Male Header, Pitch 2.5 mm, 1 x 2 Position, Height 7 mm, Tail Length 3.4 mm, -25 to 85 degC, RoHS, Bulk; Manufacturer: JST; No of Positions: 2; Pitch: 2.5mm; Style/Orientation: StraightHeader/Plug; Datasheet Version: 05/2016; Package Description: Male Header, Pitch 2.5 mm, 1 x 2 Position, Height 7 mm, Tail Length 3.4 mm; Package Reference: B2B-XH-A; Mounting Technology: ThroughHole; Type: ShroudedHeader; Datasheet URL: http://www.jst-mfg.com/product/pdf/eng/eXH.pdf; Manufacturer URL: http://www.jst.com/home2.html; Termination: Crimp
KF1 = KF2EDGK-2.54-2P: 2P, DC,KF2EDGK-2.54
L1 = IUD 0630-4.7uH/2.45A 10%: 一体成型贴片电感; Value: 10uH/2.45A; ComponentLink1Description: 供应商链接; ComponentLink1URL: http://www.szlcsc.com/product/details_12684.html
L2 = IUD 0630-10uH/2.45A 10%: 一体成型贴片电感; ComponentLink1Description: 供应商链接; ComponentLink1URL: http://www.szlcsc.com/product/details_12684.html; Value: 10uH/2.45A
LED4 = LED 0603 红灯: 发光二极管; ComponentLink1Description: 供应商链接; ComponentLink1URL: http://www.szlcsc.com/product/details_2659.html; Package: 0603; Supplier: LC; SuppliersPartNumber: C2286
LED5-LED7 = LED 0603 黄灯: 发光二极管; ComponentLink1Description: 供应商链接; ComponentLink1URL: http://www.szlcsc.com/product/details_73147.html; Package: 0603; Supplier: LC; SuppliersPartNumber: C72038
MH1-MH4 = LocatingHole
Q1 Q3 Q7 = PMOS SOT-23 AO3401A X13A15 : MOS(场效应管) PMOS; ComponentLink1Description: 供应商链接; ComponentLink1URL: http://www.szlcsc.com/product/details_15801.html; Package: SOT-23; Supplier: LC; SuppliersPartNumber: C15127
Q2 Q4-Q6 Q9 = NMOS SOT-23 AO3400A X0YV1T: MOS(场效应管) NMOS; ComponentLink1Description: 供应商链接; ComponentLink1URL: http://www.szlcsc.com/product/details_21629.html; Package: SOT-23; Supplier: LC; SuppliersPartNumber: C20917
Q8 Q10 = NPN SOT-23 SS8050 Y1: NPN 三极管; ComponentLink1Description: 供应商链接; ComponentLink1URL: http://www.szlcsc.com/product/details_2507.html; Package: SOT-23; Supplier: LC; SuppliersPartNumber: C2150
R24 R45-R47 R53 R54 = Res 0603 4.7KΩ (4701) 1%: 贴片电阻; ComponentLink1Description: 供应商链接; ComponentLink1URL: http://www.szlcsc.com/product/details_23889.html; Package: 0603; Supplier: LC; SuppliersPartNumber: C23162
R25 R28 R29 R31 R32 R35 R36 R39 R41 R43 R49 R51 = Res 0603 100KΩ (1003) 1%: 贴片电阻; ComponentLink1Description: 供应商链接; ComponentLink1URL: http://www.szlcsc.com/product/details_26546.html; Package: 0603; Supplier: LC; SuppliersPartNumber: C25803
R26 = Res 0603 49.9KΩ (4992) 1%: 贴片电阻; ComponentLink1Description: 供应商链接; ComponentLink1URL: http://www.szlcsc.com/product/details_23911.html; Package: 0603; Supplier: LC; SuppliersPartNumber: C23184
R27 = Res 0603 9.53KΩ (95B) 1%: 贴片电阻; ComponentLink1Description: 供应商链接; ComponentLink1URL: http://www.szlcsc.com/product/details_23886.html; Package: 0603; Supplier: LC; SuppliersPartNumber: C23159
R30 = Res 0603 124KΩ 1%: 贴片电阻; ComponentLink1Description: 供应商链接; ComponentLink1URL: http://www.szlcsc.com/product/details_23702.html; Package: 0603; Supplier: LC; SuppliersPartNumber: C22975
R33 = Res 0402 10KΩ (1002) 1%: 贴片电阻; ComponentLink1Description: 供应商链接; ComponentLink1URL: http://www.szlcsc.com/product/details_26487.html; Package: 0402; Supplier: LC; SuppliersPartNumber: C25744; Value: 10KΩ
R34 = Res 0603 40.2KΩ 1%: 贴片电阻; ComponentLink1Description: 供应商链接; ComponentLink1URL: http://www.szlcsc.com/product/details_23702.html; Package: 0603; Supplier: LC; SuppliersPartNumber: C22975
R37 R44 R52 = Res 0603 10KΩ (1002) 1%: 贴片电阻; ComponentLink1Description: 供应商链接; ComponentLink1URL: http://www.szlcsc.com/product/details_26547.html; Package: 0603; Supplier: LC; SuppliersPartNumber: C25804
R38 = Res 0603 200KΩ (2003) 1%: 贴片电阻; ComponentLink1Description: 供应商链接; ComponentLink1URL: http://www.szlcsc.com/product/details_26554.html; Package: 0603; Supplier: LC; SuppliersPartNumber: C25811
R40 = Res 0603 68.1KΩ 1%: 贴片电阻; ComponentLink1Description: 供应商链接; ComponentLink1URL: http://www.szlcsc.com/product/details_23702.html; Package: 0603; Supplier: LC; SuppliersPartNumber: C22975
R42 R50 = Res 0603 51KΩ (5102) 1%: 贴片电阻; ComponentLink1Description: 供应商链接; ComponentLink1URL: http://www.szlcsc.com/product/details_23923.html; Package: 0603; Supplier: LC; SuppliersPartNumber: C23196
R48 R55 = Res 0603 47KΩ (4702) 1%: 贴片电阻; ComponentLink1Description: 供应商链接; ComponentLink1URL: http://www.szlcsc.com/product/details_26562.html; Package: 0603; Supplier: LC; SuppliersPartNumber: C25819
S1 = SW SSW-1P_2: 1路波动开关; BOM名称: 波动开关; 版权归属: 源创客; 学习资源: www.ooocke.com
S2-S6 = SW SPOT_SW-1P: 1路开关; BOM名称: 波动开关; 版权归属: 源创客; 学习资源: www.ooocke.com
TP1-TP3 = TP-SM-C100-PIN: Test Point, Surface Mount, Circular, Pad Diameter 1.27 mm; ComponentLink2URL: http://www.keyelco.com/product-pdf.cfm?p=1320; ComponentLink1URL: http://www.keyelco.com/; ComponentLink1Description: Manufacturer URL; ComponentLink2Description: Datasheet
U2 = MP2359DJ-LF-Z_[C14259]: DC-DC芯片; ComponentLink1Description: 供应商链接; ComponentLink1URL: http://www.szlcsc.com/product/details_14917.html; Package: SOT-23-6; Supplier: LC; SuppliersPartNumber: C14259
U3 = MP1584EN-LF-Z_[C15051]: DC-DC芯片; ComponentLink1Description: 供应商链接; ComponentLink1URL: http://www.szlcsc.com/product/details_15724.html; Package: SOIC-8_EP_150mil; Supplier: LC; SuppliersPartNumber: C15051
U4 U6 = FDC6330L: Integrated Load Switch, 3 to 20 V, -55 to 150 degC, 6-Pin SOT23, RoHS, Tape and Reel, CMP-2000-04940-1; Manufacturer: Fairchild; Load Pulsed Current: 10A; Uni / Bi Directional Polarity: NP; No. of Outputs: 1; On / Enable Input Polarity: ActiveHigh; SMD Marking: 3544916; Power Dissipation Ptot Max: 0.7W; Continuous Drain Current Id: 2.3A; No. of Pins: 6; Protection Type: Yes; Power Load Switch Type: HighSide; Current Limit: 2.5A; Voltage Drop @ Vin 12V: 0.2V; Input Voltage Max: 20V; Transistor Polarity: NandPComplement; On State Resistance: 0.054ohm; Package Version: Rev. 5, 05/2015; On Resistance Rds(on): 0.08ohm; Voltage Off: 8V; No. of Transistors: 2; SVHC: NoSVHC(19-Dec-2012); Voltage In Min: 3V; Transistor Type: MOSFET; Operating Temperature Max: 150degC; Manufacturer URL: https://www.fairchildsemi.com/; Power Dissipation Pd: 0.7W; Package / Case: SuperSOT-6; Package URL: https://www.fairchildsemi.com/package-drawings/MA/MA06A.pdf; Datasheet URL: https://datasheet.ciiva.com/1572/276121-1572006.pdf; Package Reference: SOT23-6; Operating Temperature Range: -55degCto+150degC; Operating Temperature Min: -55degC; Drain Source Voltage Vds: 20V; Cont Load Current: 2.3A; Internal Switch: Yes; Voltage In Max: 20V; Distribution Switch Case Style: SSOT; Output Current Max: 10A; Input Voltage: 20V; Datasheet Version: Rev. C, 02/1999; Thermal Protection: Yes; Package Description: 6-Pin Small Outline Transistor, Body 2.9 x 1.6 mm, Pitch 0.95 mm; Pulse Current Idm: 10A
U5 = 74HC573D_[C5608]: 74系列逻辑芯片; ComponentLink1Description: 供应商链接; ComponentLink1URL: http://www.szlcsc.com/product/details_6059.html; Package: SOIC-20_300mil; Supplier: LC; SuppliersPartNumber: C5608
VR1 = SOT-223 AMS1117-3.3: 低压差线性稳压(LDO); ComponentLink1Description: 供应商链接; ComponentLink1URL: http://www.szlcsc.com/product/details_6652.html; Package: SOT-223; Supplier: LC; SuppliersPartNumber: C6186

## Sheet WiFi&4G_F2.SchDoc
size A4
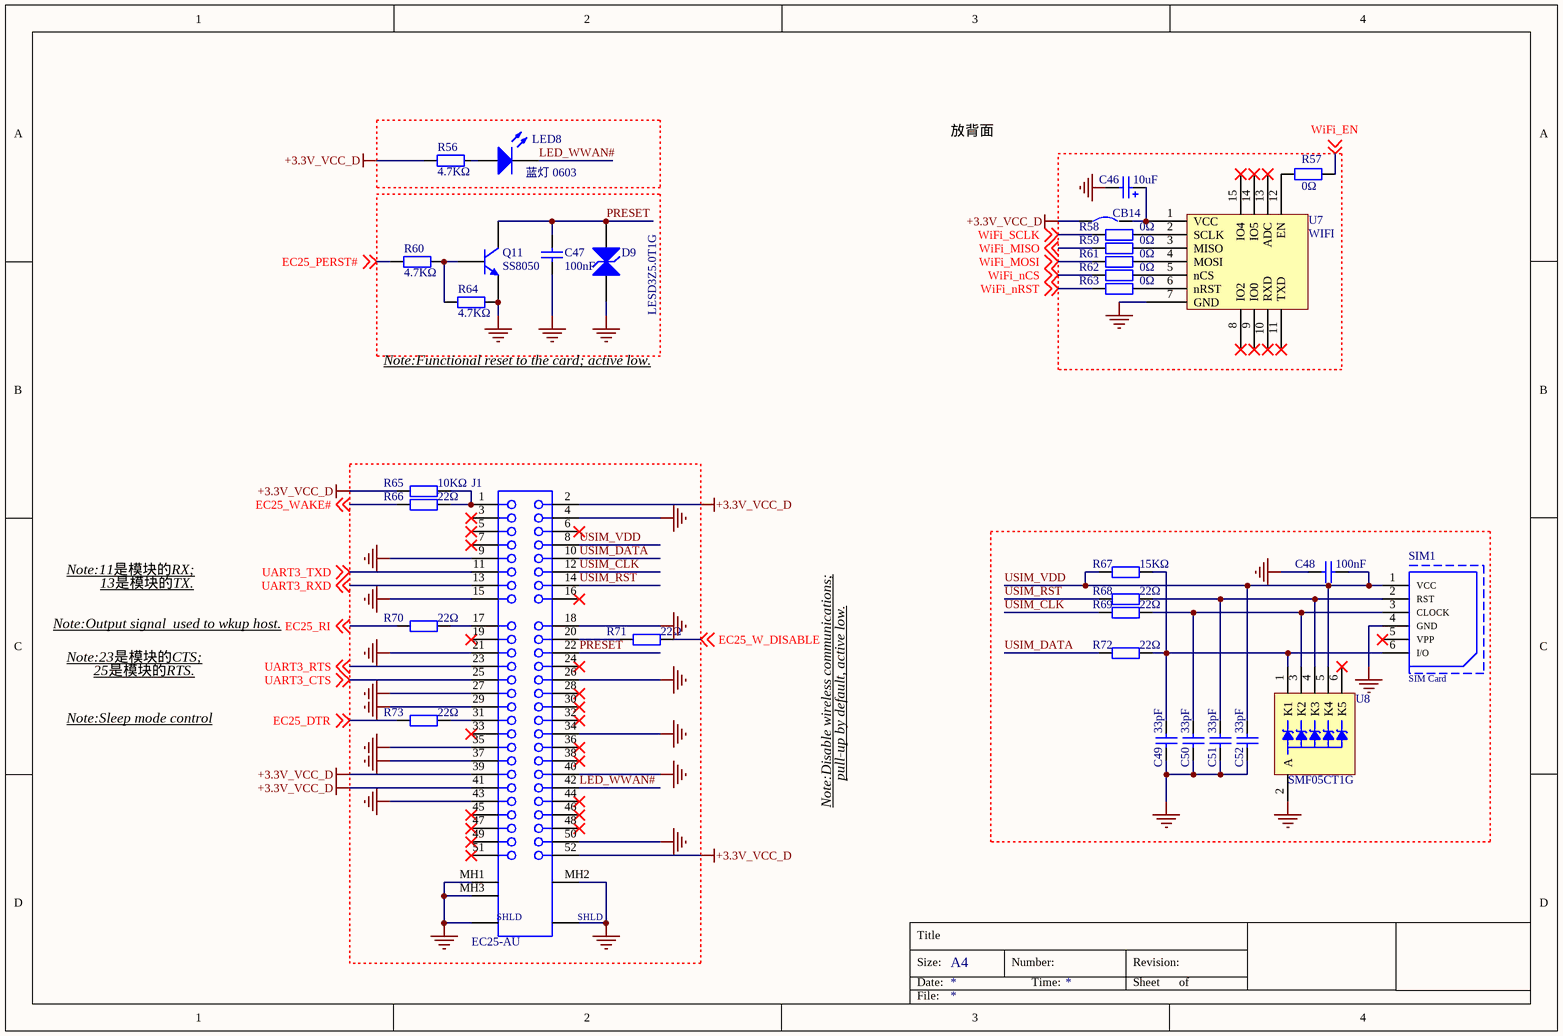
[diagram p2: WiFi&4G_F2.SchDoc]

### Parts
C46  10uF  [CASE-A_3216]
C47  100nF  [0603_C]
C48  100nF  [0402_C]
C49  33pF  [0402_C]
C50  33pF  [0402_C]
C51  33pF  [0402_C]
C52  33pF  [0402_C]
CB14  CB  [CW]  (value not drawn)  (no BOM)
D9  LESD3Z5.0T1G  [SOD-323]
J1  EC25-AU  [PCIEmin-i]
LED8  蓝灯 0603  [0603_LED_S1]
Q11  SS8050  [SOT-23(SOT-23-3)]
R56  4.7KΩ  [0603_R]
R57  0Ω  [0402_R]
R58  0Ω  [0402_R]
R59  0Ω  [0402_R]
R60  4.7KΩ  [0603_R]
R61  0Ω  [0402_R]
R62  0Ω  [0402_R]
R63  0Ω  [0402_R]
R64  4.7KΩ  [0603_R]
R65  10KΩ  [0402_R]
R66  22Ω  [0402_R]
R67  15KΩ  [0402_R]
R68  22Ω  [0402_R]
R69  22Ω  [0402_R]
R70  22Ω  [0402_R]
R71  22Ω  [0402_R]
R72  22Ω  [0402_R]
R73  22Ω  [0402_R]
SIM1  SIM Card  [SIM Card]
U7  WIFI  [MT8266WIFI-H]
U8  SMF05CT1G  [SC-70-6(SOT-363)]

### Nets
+3.3V_VCC_D: CB14.1 J1.2 J1.39 J1.41 J1.52 R56.2 R65.1
GND: C46.2 C47.1 C48.1 C49.1 C50.1 C51.1 C52.1 D9.1(A) J1.4 J1.9 J1.15 J1.18 J1.21 J1.26 J1.27 J1.29 J1.34 J1.35 J1.37 J1.40 J1.43 J1.50 J1.53(SHLD) J1.54(SHLD) J1.MH1 J1.MH2 J1.MH3 Q11.2(E) R64.2 SIM1.4(GND) U7.7(GND) U8.2(A)
EC25_DTR: R73.1 ; off-sheet EC25_DTR
EC25_PERST#: R60.1 ; off-sheet EC25_PERST#
EC25_RI: R70.1 ; off-sheet EC25_RI
EC25_W_DISABLE: R71.2 ; off-sheet EC25_W_DISABLE
EC25_WAKE#: R66.1 ; off-sheet EC25_WAKE#
LED_WWAN#: J1.42 LED8.K
PRESET: C47.2 D9.2(K) J1.22 Q11.3(C)
UART3_CTS: J1.25 ; off-sheet UART3_CTS
UART3_RTS: J1.23 ; off-sheet UART3_RTS
UART3_RXD: J1.13 ; off-sheet UART3_RXD
UART3_TXD: J1.11 ; off-sheet UART3_TXD
USIM_CLK: J1.12 R69.1
USIM_DATA: J1.10 R72.1
USIM_RST: J1.14 R68.1
USIM_VDD: C48.2 C52.2 J1.8 R67.2 SIM1.1(VCC) U8.5(K4)
WiFi_EN: R57.2 ; off-sheet WiFi_EN
WiFi_MISO: R59.1 ; off-sheet WiFi_MISO
WiFi_MOSI: R61.1 ; off-sheet WiFi_MOSI
WiFi_nCS: R62.1 ; off-sheet WiFi_nCS
WiFi_nRST: R63.1 ; off-sheet WiFi_nRST
WiFi_SCLK: R58.1 ; off-sheet WiFi_SCLK
NetC46_1: C46.1 CB14.2 U7.1(VCC)
NetC49_2: C49.2 R67.1 R72.2 SIM1.6(I/O) U8.1(K1)
NetC50_2: C50.2 R69.2 SIM1.3(CLOCK) U8.3(K2)
NetC51_2: C51.2 R68.2 SIM1.2(RST) U8.4(K3)
NetJ1_1: J1.1 R65.2 R66.2
NetJ1_17: J1.17 R70.2
NetJ1_20: J1.20 R71.1
NetJ1_31: J1.31 R73.2
NetLED8_A: LED8.A R56.1
NetQ11_1: Q11.1(B) R60.2 R64.1
NetR57_1: R57.1 U7.12(EN)
NetR58_2: R58.2 U7.2(SCLK)
NetR59_2: R59.2 U7.3(MISO)
NetR61_2: R61.2 U7.4(MOSI)
NetR62_2: R62.2 U7.5(nCS)
NetR63_2: R63.2 U7.6(nRST)

Not connected (* = marked no-connect by the designer): J1 3* 5* 6* 7* 16* 19* 24* 28* 30* 32* 33* 36* 38* 44* 45* 46* 47* 48* 49* 51*; SIM1 5(VPP)*; U7 8(IO2)* 9(IO0)* 10(RXD)* 11(TXD)* 13(ADC)* 14(IO5)* 15(IO4)*; U8 6(K5)*

### Notes on the sheet
- 放背面
- Note:Functional reset to the card; active low.
- Note:11是模块的RX;
- Note:Output signal  used to wkup host.
- 13是模块的TX.
- Note:23是模块的CTS;
- 25是模块的RTS.
- Note:Sleep mode control
- pull-up by default, active low.
- Note:Disable wireless communications;
- Title
- Size:
- Date:
- A4
- Number:
- Time:
- Revision:
- Sheet
- of
- File:
- *

### Library data of the parts
C46 = Cap 3216 10uF (106) 10% 16V: 钽电容; ComponentLink1Description: 供应商链接; ComponentLink1URL: http://www.szlcsc.com/product/details_7643.html; Package: 3216; Supplier: LC; SuppliersPartNumber: C7171
C47 = Cap 0603 100nF (104) 10% 50V: 贴片电容; ComponentLink1Description: 供应商链接; ComponentLink1URL: http://www.szlcsc.com/product/details_15331.html; Package: 0603; Supplier: LC; SuppliersPartNumber: C14663
C48 = Cap 0402 100nF (104) 10% 16V: 贴片电容; ComponentLink1Description: 供应商链接; ComponentLink1URL: http://www.szlcsc.com/product/details_1877.html; Package: 0402; Supplier: LC; SuppliersPartNumber: C1525
C49-C52 = Cap 0402 33pF (330) 5% 50V: 贴片电容; ComponentLink1Description: 供应商链接; ComponentLink1URL: http://www.szlcsc.com/product/details_1914.html; Package: 0402; Supplier: LC; SuppliersPartNumber: C1562
CB14 = Circuit Breaker: Published: 24-Mar-1999; LatestRevisionDate: 17-Jul-2002; LatestRevisionNote: Re-released for DXP Platform.; PackageReference: SPST-2; Publisher: Altium Limited
D9 = SOD-323 LESD3Z5.0T1G: TVS/ESD, SOD-323, 5V; ComponentLink1Description: 供应商链接; ComponentLink1URL: http://www.szlcsc.com/product/details_79530.html; Package: SMB/DO-214AA; Supplier: LC; SuppliersPartNumber: C78395
J1 = PCIE-Mini: Female Header, Pitch 0.8 mm, 2 x 26 Position, Height 9.9 mm, -40 to 85 degC, RoHS, Tape and Reel, CMP-2000-05614-1, 48338-0099; Brand: Molex; Number of Positions / Contacts: 52; Mounting Angle: Right; Housing Material: Thermoplastic; Mounting Style: SMD/SMT; Series: 48338; Contact Plating: Gold; Product Category: PCIExpress/PCIConnectors; Factory Pack Quantity: 300; Manufacturer: Molex; Package Description: 52-Pin Surface Mount Device, Body 30 x 9.3 mm, Pitch 0.8 mm; Datasheet Version: Rev. F, 06/2009; Mounting Technology: SurfaceMount; Packaging: Reel; Product Type: MiniPCI; Package Reference: 48338-0099; Manufacturer URL: http://www.molex.com/; Contact Material: CopperAlloy; Datasheet URL: http://www.molex.com/pdm_docs/sd/483380099_sd.pdf; Number of Positions: 52; RoHS: Details
LED8 = LED 0603 蓝灯: 发光二极管; ComponentLink1Description: 供应商链接; ComponentLink1URL: http://www.szlcsc.com/product/details_73150.html; Package: 0603; Supplier: LC; SuppliersPartNumber: C72041
Q11 = NPN SOT-23 SS8050 Y1: NPN 三极管; ComponentLink1Description: 供应商链接; ComponentLink1URL: http://www.szlcsc.com/product/details_2507.html; Package: SOT-23; Supplier: LC; SuppliersPartNumber: C2150
R56 R60 R64 = Res 0603 4.7KΩ (4701) 1%: 贴片电阻; ComponentLink1Description: 供应商链接; ComponentLink1URL: http://www.szlcsc.com/product/details_23889.html; Package: 0603; Supplier: LC; SuppliersPartNumber: C23162
R57-R59 R61-R63 = Res 0402 0Ω (0R0) 1%: 贴片电阻; ComponentLink1Description: 供应商链接; ComponentLink1URL: http://www.szlcsc.com/product/details_17853.html; Package: 0402; Supplier: LC; SuppliersPartNumber: C17168; Value: 0Ω
R65 = Res 0402 10KΩ (1002) 1%: 贴片电阻; ComponentLink1Description: 供应商链接; ComponentLink1URL: http://www.szlcsc.com/product/details_26487.html; Package: 0402; Supplier: LC; SuppliersPartNumber: C25744; Value: 10KΩ
R66 R68-R73 = Res 0402 22Ω (22R0) 1%: 贴片电阻; ComponentLink1Description: 供应商链接; ComponentLink1URL: http://www.szlcsc.com/product/details_25835.html; Package: 0402; Supplier: LC; SuppliersPartNumber: C25092; Value: 22Ω
R67 = Res 0402 15KΩ (1502) 1%: 贴片电阻; ComponentLink1Description: 供应商链接; ComponentLink1URL: http://www.szlcsc.com/product/details_26499.html; Package: 0402; Supplier: LC; SuppliersPartNumber: C25756
SIM1 = SIM Card MUP: MUP, 6P; Manufacturer: Wurth Elektronik; Part Number: 693010020611; Working Voltage: 50VAC; Rated Current: 0.5A; Withstanding Voltage: 500VAC; Packaging: TapeandReel; Manufacturer URL: http://www.we-online.de; Operating Temperature: -25to85degC; Publisher: WurthElektronik; Package Reference: 693010020611; Datasheet URL: https://katalog.we-online.de/em/datasheet/693010020611.pdf; Mounting Technology: SMT; Taobao: https://item.taobao.com/item.htm?spm=a230r.1.14.37.7dfabe7eHV2uMn&id=550214241835&ns=1&abbucket=6#detail
U7 = MT8266WIFI
U8 = SMF05CT1G_[C15879]_i: TVS; ComponentLink1Description: 供应商链接; ComponentLink1URL: http://www.szlcsc.com/product/details_16561.html; Package: SC-70-6(SOT-363); Supplier: LC; SuppliersPartNumber: C15879